# EAGLE design Own_LDO3.dev_v1.0_Final_AR (EAGLE 9.6.2)
COMPANY: ADAFRUIT INDUSTRIES; DRAWN: KTOWN; REV: A; YEAR: 2019
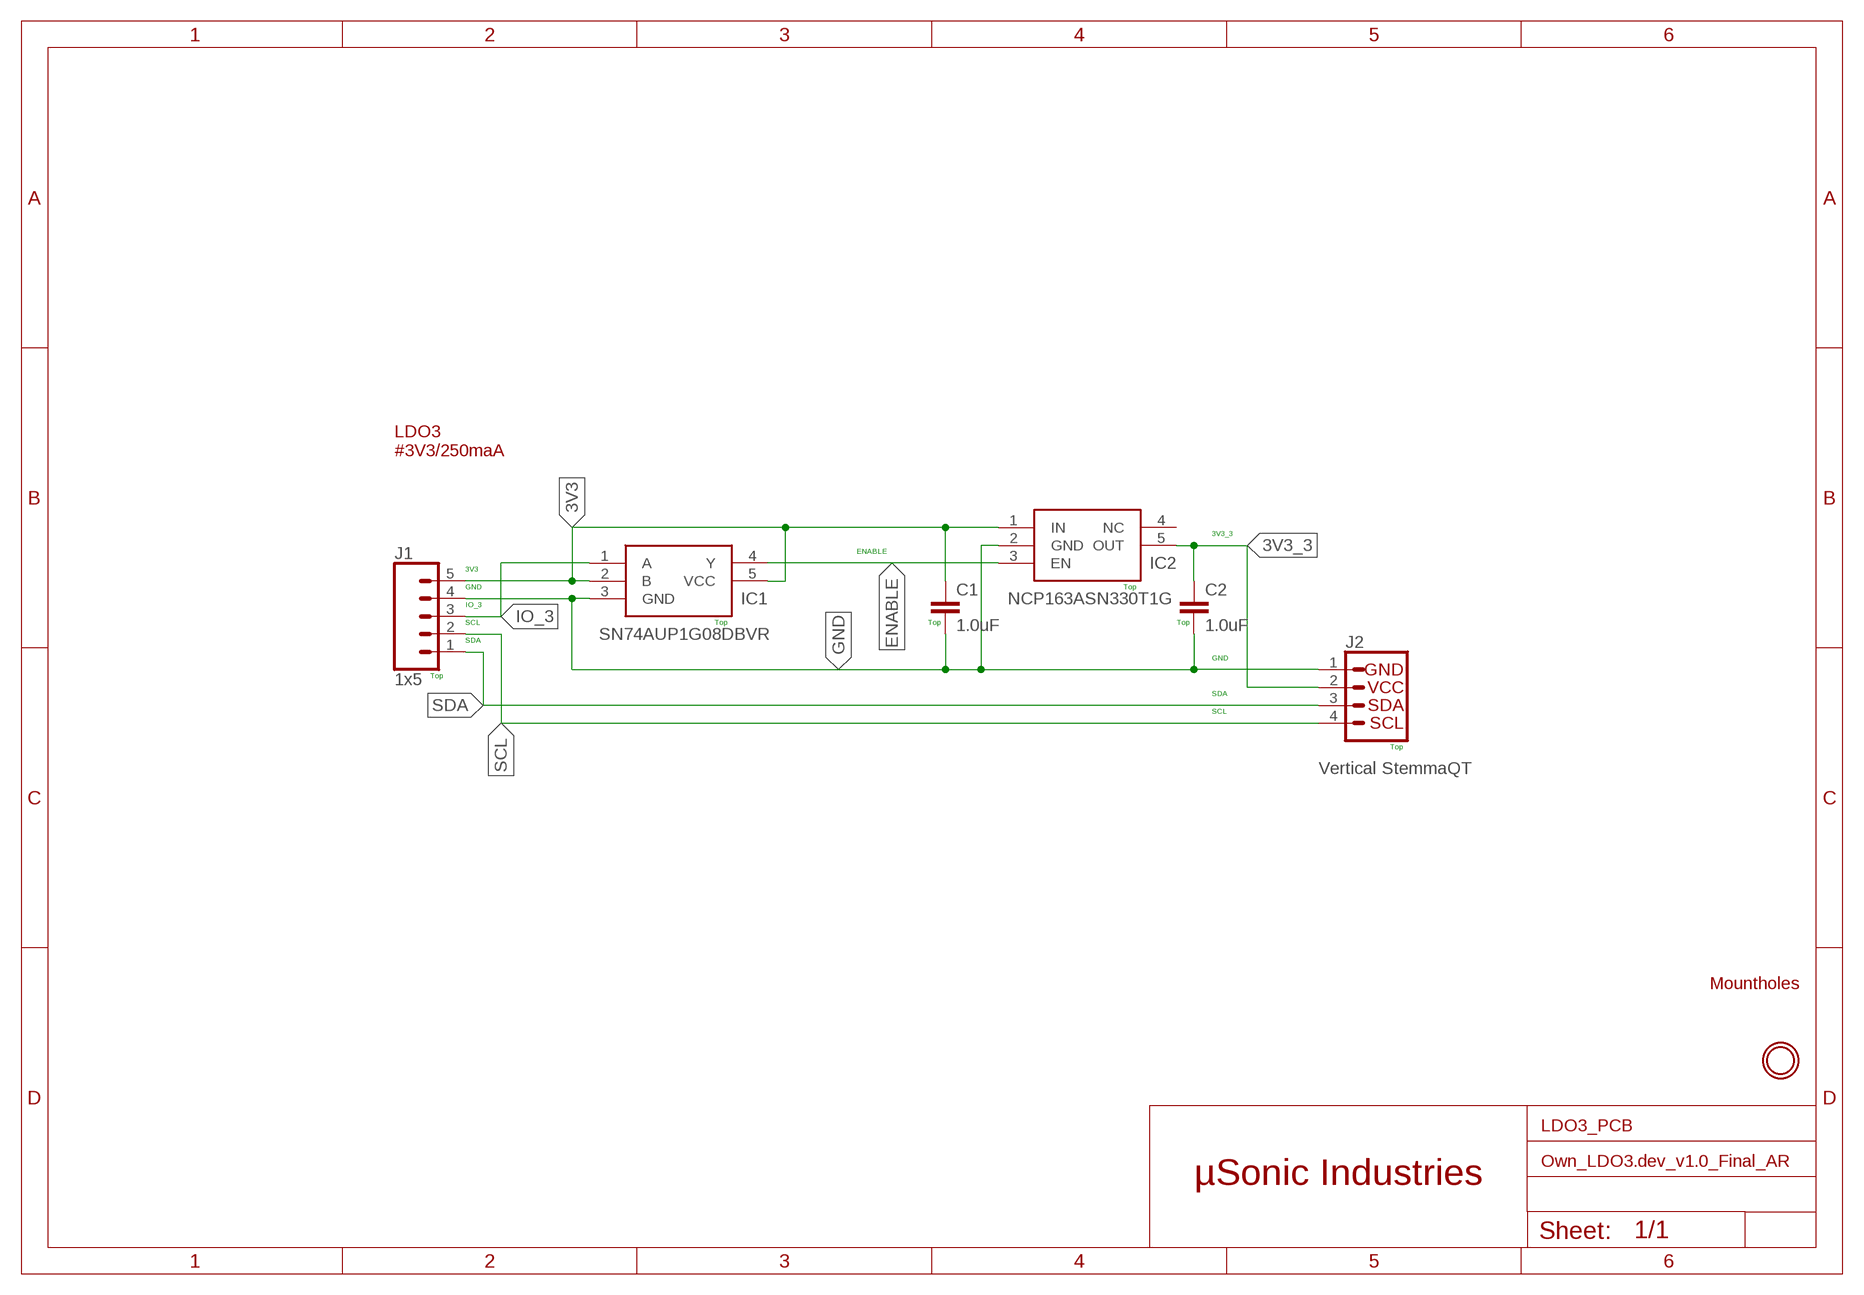
[diagram p0: schematic, sheet 1]

## Parts
C1  1.0uF  1.0UF-0805-25V-10%  [0805]
C2  1.0uF  1.0UF-0805-25V-10%  [0805]
IC1  SN74AUP1G08DBVR  [SOT95P280X145-5N]
IC2  NCP163ASN330T1G  [SOT95P280X145-5N]
J1  1x5  CONN_05NO_SILK  [1X05_NO_SILK]
J2  Vertical StemmaQT  QWIIC_CONNECTOROWN  [JST04_1MM_VERT]
U$1  MOUNTINGHOLE2.5  [MOUNTINGHOLE_2.5_PLATED]

## Nets
3V3: C1.1 IC1.2(B) IC1.5(VCC) IC2.1(IN) J1.5
3V3_3: C2.1 IC2.5(OUT) J2.2
ENABLE: IC1.4(Y) IC2.3(EN)
GND: C1.2 C2.2 IC1.3(GND) IC2.2(GND) J1.4 J2.1
IO_3: IC1.1(A) J1.3
SCL: J1.2 J2.4
SDA: J1.1 J2.3
Unconnected: IC2.4(NC)

## Notes on the sheet
- LDO3
  #3V3/250maA
- 3V3_3
- ENABLE
- 3V3
- GND | Top
- IO_3
- SCL | Top | Top | Top
- SDA
- GND
- Top
- SDA
- SCL
- Top
- Mountholes
- LDO3_PCB
- µSonic Industries

## Library data of the parts
C1 C2 = SparkFun-Capacitors:1.0UF: 1µF ceramic capacitors A capacitor is a passive two-terminal electrical component used to store electrical energy temporarily in an electric field.; PROD_ID: CAP-08064
IC1 = SN74AUP1G08DBVR:SN74AUP1G08DBVR: Low-Power Single 2-Input Positive-AND Gate Source: Datasheet <http://www.ti.com/lit/gpn/sn74aup1g08>; ARROW_PART_NUMBER: SN74AUP1G08DBVR; ARROW_PRICE-STOCK: https://www.arrow.com/en/products/sn74aup1g08dbvr/texas-instruments?region=nac; DESCRIPTION: Low-Power Single 2-Input Positive-AND Gate; HEIGHT: 1.45mm; MANUFACTURER_NAME: Texas Instruments; MANUFACTURER_PART_NUMBER: SN74AUP1G08DBVR; MOUSER_PART_NUMBER: 595-SN74AUP1G08DBVR; MOUSER_PRICE-STOCK: https://www.mouser.co.uk/ProductDetail/Texas-Instruments/SN74AUP1G08DBVR?qs=iO7mgM19OaaX3OxsHkQOcg%3D%3D
IC2 = NCP163ASN330T1G:NCP163ASN330T1G: ON SEMICONDUCTOR - NCP163ASN330T1G - Fixed LDO Voltage Regulator, 2.2V to 5.5V, 105mV drop, 3.3V/250mA out, SOT-23-5 Source: Datasheet <https://componentsearchengine.com/Datasheets/2/NCP163ASN330T1G.pdf>; ARROW_PART_NUMBER: NCP163ASN330T1G; ARROW_PRICE-STOCK: https://www.arrow.com/en/products/ncp163asn330t1g/on-semiconductor?region=nac; DESCRIPTION: ON SEMICONDUCTOR - NCP163ASN330T1G - Fixed LDO Voltage Regulator, 2.2V to 5.5V, 105mV drop, 3.3V/250mA out, SOT-23-5; HEIGHT: 1.45mm; MANUFACTURER_NAME: onsemi; MANUFACTURER_PART_NUMBER: NCP163ASN330T1G; MOUSER_PART_NUMBER: 863-NCP163ASN330T1G; MOUSER_PRICE-STOCK: https://www.mouser.co.uk/ProductDetail/onsemi/NCP163ASN330T1G?qs=vLWxofP3U2ykJIQb1%252BPKcA%3D%3D
J1 = SparkFun-Connectors2:CONN_05: Multi connection point. Often used as Generic Header-pin footprint for 0.1 inch spaced/style header connections On any of the 0.1 inch spaced packages, you can populate with these: Break Away Headers - Straight <https://www.sparkfun.com/products/116> (PRT-00116) Break Away Male Headers - Right Angle <https://www.sparkfun.com/products/553> (PRT-00553) Female Headers <https://www.sparkfun.com/products/115> (PRT-00115) Break Away Headers - Machine Pin <https://www.sparkfun.com/products/117> (PRT-00117) Break Away Female Headers - Swiss Machine Pin <https://www.sparkfun.com/products/743> (PRT-00743) For SCREWTERMINALS and SPRING TERMINALS visit here: Screw Terimnals on SparkFun.com <https://www.sparkfun.com/search/results?term=Screw+Terminals> (5mm/3.5mm/2.54mm spacing) This device is also useful as a general connection point to wire up your design to another part of your project. Our various solder wires solder well into these plated through hole pads. Hook-Up Wire - Assortment (Stranded, 22 AWG) <https://www.sparkfun.com/products/11375> (PRT-11375) Hook-Up Wire - Assortment (Solid Core, 22 AWG) <https://www.sparkfun.com/products/11367> (PRT-11367) View the entire wire category on our website here <https://www.sparkfun.com/categories/141> Special notes: Molex polarized connector foot print use with SKU : PRT-08231 with associated crimp pins and housings. 1MM SMD Version SKU: PRT-10208
J2 = SparkFun-Connectors2:QWIIC_CONNECTOR: SparkFun I2C Standard Qwiic Connector An SMD 1mm pitch JST connector makes it easy and quick (get it? Qwiic?) to connect I2C devices to each other. The Qwiic system <http://www.sparkfun.com/qwiic> enables fast and solderless connection between popular platforms and various sensors and actuators. We carry 200mm <https://www.sparkfun.com/products/14204>, 100mm <https://www.sparkfun.com/products/14205>, 50mm <https://www.sparkfun.com/products/14206>, and breadboard friendly <https://www.sparkfun.com/products/14207> Qwiic cables. We also offer 10 pcs strips <https://www.sparkfun.com/products/14323> the SMD connectors.; PROD_ID: CONN-14483; VALUE: Vertical Qwiic Connector
U$1 = microbuilder:MOUNTINGHOLE: Mounting Hole For #2 screws (0.086"/2.18mm width, 0.094"/2.4mm hole) use 2.5mm; BOM: EXCLUDE

## Net classes
0 default: width 0.25 mm

## Board
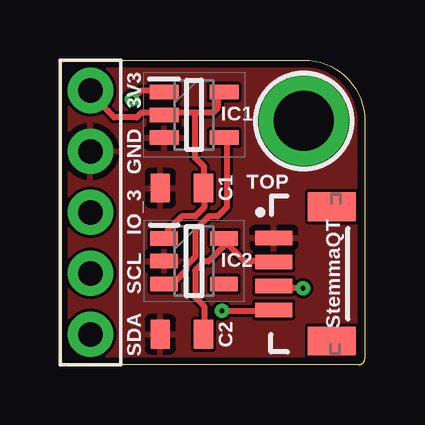
[diagram p1: board, top side]
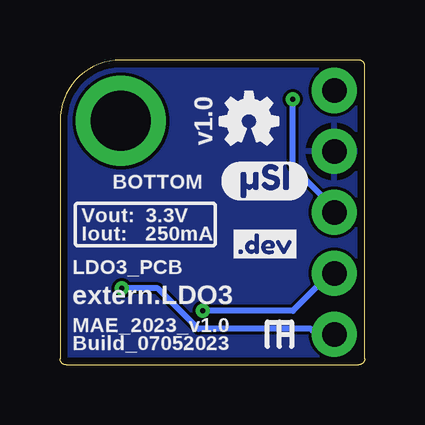
[diagram p2: board, bottom side, seen from below]

Size 12.7 x 12.7 mm. Coordinates in mm from the lower left corner, seen from the top.
Outline: 0,0.25 0,12.45 arc-90 0.25,12.7 10.16,12.7 arc-90 12.7,10.16 12.7,0.25 arc-90 12.45,0 0.25,0 arc-90 0,0.25
Copper layers (1*16): Top 0.035mm / dielectric 1.5mm / Bottom 0.035mm
Design rules "aisler_2_layer_complex": minimum track width 0.125mm, minimum drill 0.2mm, track to track 0.125mm, track to pad 0.125mm, pad to pad 0.125mm, via to via 0.125mm, smd to smd 0.125mm, copper to edge 0.3mm, drill to drill 0.25mm, minimum pad ring 0.2mm, minimum via ring 0.2mm, stop-mask expansion 0mil, vias tented up to drill 0mil, thermal gap 10mil

### Footprints (pad centres in the part's own frame; a part is rotated, then mirrored left to right if it is on the bottom)
0805 = smd 0.8 x 1.2: 1 -0.9,0; 2 0.9,0
SOT95P280X145-5N = smd 1.2 x 0.6: 1 -1.25,0.95; 2 -1.25,0; 3 -1.25,-0.95; 4 1.25,-0.95; 5 1.25,0.95
SOT95P280X145-5N' = smd 1.15 x 0.6: 1 -1.25,0.95; 2 -1.25,0; 3 -1.25,-0.95; 4 1.25,-0.95; 5 1.25,0.95
1X05_NO_SILK = drill 1.016 pad 1.88: 1 0,0; 2 2.54,0; 3 5.08,0; 4 7.62,0; 5 10.16,0
JST04_1MM_VERT = smd 0.6 x 1.55: 1 -1.478,0.775; 2 -0.478,0.775; 3 0.522,0.775; 4 1.522,0.775 | smd 1.2 x 2: NC1 -2.778,3.2; NC2 2.822,3.2
MOUNTINGHOLE_2.5_PLATED = drill 2.5 pad 3.2: P$1 0,0

### Placement (x,y rotation side)
C1  5.08,7.37 180 top
C2  5.08,1.27 180 top
IC1  5.59,10.41 0 top
IC2  NCP163ASN330T1G  [SOT95P280X145-5N']  5.59,4.32 0 top
J1  1.27,1.27 90 top
J2  8.13,3.81 270 top
U$1  10.16,10.16 180 top
U$2  [OSHW-LOGO-MINI]  4.83,10.16 0 bottom
U$3  [DEV2]  5.46,4.45 0 bottom
U$4  [µSI2]  5.97,6.86 0 bottom

### Tracks (layer width: path | path; a pad name or v marks a point on that pad's centre or on a via)
3V3
  Top 0.25: 5.62,10.5 6.38,10.5 6.56,10.69 6.56,11.25 6.75,11.44 IC1.5 | 5.62,10.5 4.5,10.5 IC1.2 4.31,10.5 3.38,10.5 3.19,10.31 2.25,10.31 1.31,11.25 J1.5 | IC2.1 4.5,5.44 4.5,5.62 5.06,6.19 5.62,6.19 6,6.56 6,7.31 C1.1 6,7.5 6,8.25 5.62,8.62 5.62,10.5
3V3_3
  Top 0.25: 6.94,5.06 6.94,5.25 IC2.5 6.94,5.06 | 6.94,5.06 7.69,4.31 8.81,4.31 J2.2 | 6.94,5.06 6.19,4.31 6,4.31 5.62,3.94 5.62,2.81 6,2.44 6,1.31 C2.1
ENABLE
  Top 0.25: IC2.3 4.5,3.38 4.69,3.38 5.25,3.94 5.25,4.12 5.62,4.5 5.62,5.62 6.19,6.19 6.56,6.19 6.94,6.56 6.94,9.38 IC1.4
GND
  pour Top: 0,0 12.7,0 12.7,12.7 0,12.7
  pour Bottom: 0,0 12.7,0 12.7,12.7 0,12.7
IO_3  (via drill 0.2)
  Top 0.25: v3,11.06 3.38,11.44 4.31,11.44 IC1.1
  Bottom 0.25: v3,11.06 3,8.25 1.12,6.38 J1.3
SCL  (via drill 0.2)
  Top 0.25: v6.75,2.25 8.81,2.25 J2.4
  Bottom 0.25: v6.75,2.25 3,2.25 1.31,3.94 J1.2
SDA  (via drill 0.2)
  Top 0.25: v10.12,3.19 9,3.19 J2.3
  Bottom 0.25: v10.12,3.19 8.62,3.19 6.94,1.5 2.25,1.5 2.06,1.31 1.31,1.31 J1.1

### Text on the board
tPlace: 3V3 | IC1 | GND | TOP | C1 | IO_3 | SCL | IC2 | StemmaQT | SDA | C2
bPlace: v1.0 | BOTTOM | 3.3V | Vout: | 250mA | Iout: | LDO3_PCB | extern.LDO3 | MAE_2023_v1.0 / Build_07052023